# EAGLE design mainboard 1.1 (EAGLE 5.10)
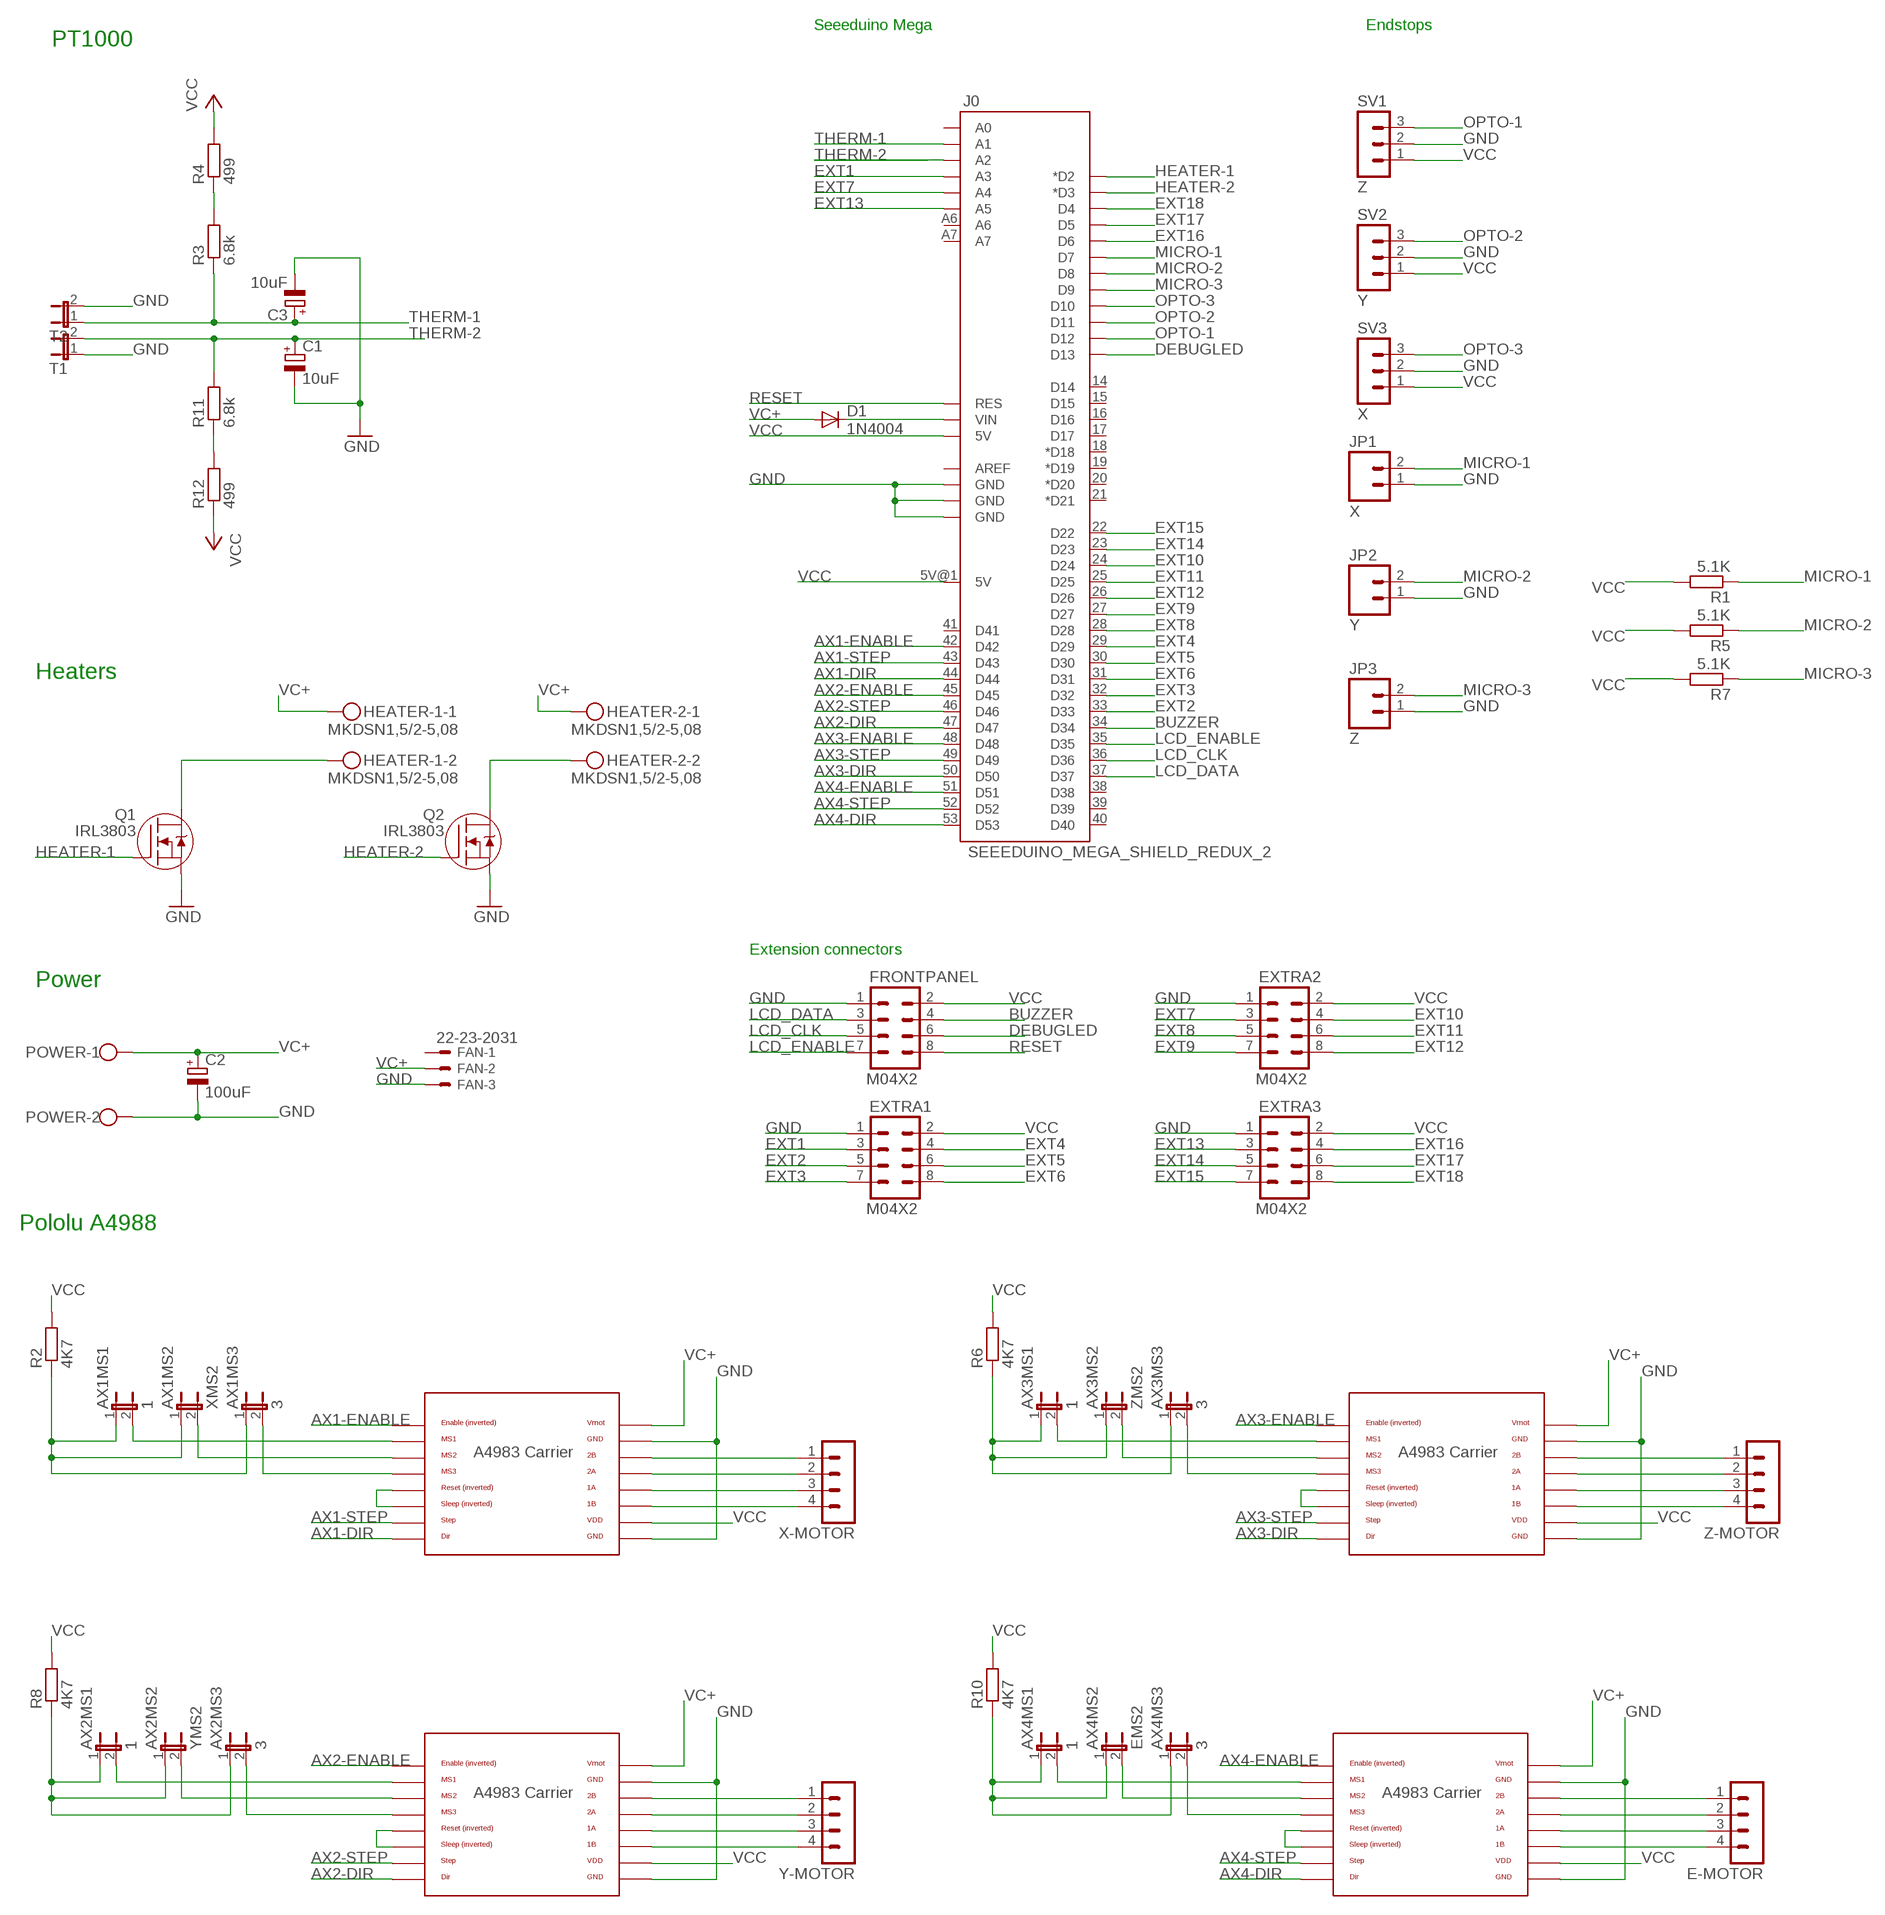
[diagram p0: schematic, sheet 1]

## Parts
AX1MS1  1  JUMPER-2PTH  [1X02]
AX1MS2  XMS2  JUMPER-2PTH  [1X02]
AX1MS3  3  JUMPER-2PTH  [1X02]
AX2MS1  1  JUMPER-2PTH  [1X02]
AX2MS2  YMS2  JUMPER-2PTH  [1X02]
AX2MS3  3  JUMPER-2PTH  [1X02]
AX3MS1  1  JUMPER-2PTH  [1X02]
AX3MS2  ZMS2  JUMPER-2PTH  [1X02]
AX3MS3  3  JUMPER-2PTH  [1X02]
AX4MS1  1  JUMPER-2PTH  [1X02]
AX4MS2  EMS2  JUMPER-2PTH  [1X02]
AX4MS3  3  JUMPER-2PTH  [1X02]
C1  10uF  CPOL-EUE2.5-6  [E2,5-6]
C2  100uF  CPOL-EUE2.5-6  [E2,5-6]
C3  10uF  CPOL-EUE2.5-6  [E2,5-6]
D1  1N4004  [DO41-10]
E-AXIS  POLOLU_A4983CARRIER  [A4983CARRIER]
E-MOTOR  MA04-1  [MA04-1]
EXTRA1  M04X2  [2X4]
EXTRA2  M04X2  [2X4]
EXTRA3  M04X2  [2X4]
FAN  22-23-2031  [22-23-2031]
FRONTPANEL  M04X2  [2X4]
HEATER-1  MKDSN1,5/2-5,08  [MKDSN1,5/2-5,08]
HEATER-2  MKDSN1,5/2-5,08  [MKDSN1,5/2-5,08]
J0  SEEEDUINO_MEGA_SHIELD_REDUX_2  [SEEEDUINO_MEGA_SHIELD_REDUX_2]
JP1  X  M02PTH  [1X02]
JP2  Y  M02PTH  [1X02]
JP3  Z  M02PTH  [1X02]
POWER  W237-102  [W237-102]
Q1  IRL3803  [TO220AB]
Q2  IRL3803  [TO220AB]
R1  5.1K  R-EU_0204/7  [0204/7]
R2  4K7  R-EU_0204/7  [0204/7]
R3  6.8k  R-EU_0204/7  [0204/7]
R4  499  R-EU_0204/7  [0204/7]
R5  5.1K  R-EU_0204/7  [0204/7]
R6  4K7  R-EU_0204/7  [0204/7]
R7  5.1K  R-EU_0204/7  [0204/7]
R8  4K7  R-EU_0204/7  [0204/7]
R10  4K7  R-EU_0204/7  [0204/7]
R11  6.8k  R-EU_0204/7  [0204/7]
R12  499  R-EU_0204/7  [0204/7]
SV1  Z  MA03-1  [MA03-1]
SV2  Y  MA03-1  [MA03-1]
SV3  X  MA03-1  [MA03-1]
T1  JUMPER-2-OLDPTH  [1X02]
T2  JUMPER-2-OLDPTH  [1X02]
X-AXIS  POLOLU_A4983CARRIER  [A4983CARRIER]
X-MOTOR  MA04-1  [MA04-1]
Y-AXIS  POLOLU_A4983CARRIER  [A4983CARRIER]
Y-MOTOR  MA04-1  [MA04-1]
Z-AXIS  POLOLU_A4983CARRIER  [A4983CARRIER]
Z-MOTOR  MA04-1  [MA04-1]

## Nets
AX1-DIR: J0.44(D44) X-AXIS.DIR
AX1-ENABLE: J0.42(D42) X-AXIS.EN
AX1-STEP: J0.43(D43) X-AXIS.STEP
AX2-DIR: J0.47(D47) Y-AXIS.DIR
AX2-ENABLE: J0.45(D45) Y-AXIS.EN
AX2-STEP: J0.46(D46) Y-AXIS.STEP
AX3-DIR: J0.50(D50) Z-AXIS.DIR
AX3-ENABLE: J0.48(D48) Z-AXIS.EN
AX3-STEP: J0.49(D49) Z-AXIS.STEP
AX4-DIR: E-AXIS.DIR J0.53(D53)
AX4-ENABLE: E-AXIS.EN J0.51(D51)
AX4-STEP: E-AXIS.STEP J0.52(D52)
BUZZER: FRONTPANEL.4 J0.34(D34)
DEBUGLED: FRONTPANEL.6 J0.13(D13)
EXT1: EXTRA1.3 J0.A3
EXT2: EXTRA1.5 J0.33(D33)
EXT3: EXTRA1.7 J0.32(D32)
EXT4: EXTRA1.4 J0.29(D29)
EXT5: EXTRA1.6 J0.30(D30)
EXT6: EXTRA1.8 J0.31(D31)
EXT7: EXTRA2.3 J0.A4
EXT8: EXTRA2.5 J0.28(D28)
EXT9: EXTRA2.7 J0.27(D27)
EXT10: EXTRA2.4 J0.24(D24)
EXT11: EXTRA2.6 J0.25(D25)
EXT12: EXTRA2.8 J0.26(D26)
EXT13: EXTRA3.3 J0.A5
EXT14: EXTRA3.5 J0.23(D23)
EXT15: EXTRA3.7 J0.22(D22)
EXT16: EXTRA3.4 J0.6(D6)
EXT17: EXTRA3.6 J0.5(D5)
EXT18: EXTRA3.8 J0.4(D4)
GND [GND]: C1.- C2.- C3.- E-AXIS.GND E-AXIS.GND@0(GND) EXTRA1.1 EXTRA2.1 EXTRA3.1 FAN.3 FRONTPANEL.1 J0.GND@0(GND) J0.GND@1(GND) J0.GND@2(GND) JP1.1 JP2.1 JP3.1 POWER.2 Q1.S Q2.S SV1.2 SV2.2 SV3.2 T1.1 T2.2 X-AXIS.GND X-AXIS.GND@0(GND) Y-AXIS.GND Y-AXIS.GND@0(GND) Z-AXIS.GND Z-AXIS.GND@0(GND)
HEATER-1: J0.2(*D2) Q1.G
HEATER-2: J0.3(*D3) Q2.G
LCD_CLK: FRONTPANEL.5 J0.36(D36)
LCD_DATA: FRONTPANEL.3 J0.37(D37)
LCD_ENABLE: FRONTPANEL.7 J0.35(D35)
MICRO-1: J0.7(D7) JP1.2 R1.1
MICRO-2: J0.8(D8) JP2.2 R5.1
MICRO-3: J0.9(D9) JP3.2 R7.1
N$1 [Heavy GND]: HEATER-2.2 Q2.D
N$2: AX1MS1.1 AX1MS2.1 AX1MS3.1 R2.1
N$3: X-AXIS.RST X-AXIS.SLP(SLEEP)
N$4: AX1MS3.2 X-AXIS.MS3
N$5: AX1MS2.2 X-AXIS.MS2
N$6: AX1MS1.2 X-AXIS.MS1
N$7 [Motor 12V]: X-AXIS.2B X-MOTOR.1
N$8 [Motor 12V]: X-AXIS.2A X-MOTOR.2
N$9 [Motor 12V]: X-AXIS.1A X-MOTOR.3
N$10 [Motor 12V]: X-AXIS.1B X-MOTOR.4
N$12: Z-AXIS.RST Z-AXIS.SLP(SLEEP)
N$13 [+12V]: D1.C J0.VIN
N$16: AX3MS3.2 Z-AXIS.MS3
N$17: AX3MS2.2 Z-AXIS.MS2
N$18: AX3MS1.2 Z-AXIS.MS1
N$19 [Motor 12V]: Z-AXIS.2B Z-MOTOR.1
N$20 [Motor 12V]: Z-AXIS.2A Z-MOTOR.2
N$21 [Motor 12V]: Z-AXIS.1A Z-MOTOR.3
N$22 [Motor 12V]: Z-AXIS.1B Z-MOTOR.4
N$23: AX2MS1.1 AX2MS2.1 AX2MS3.1 R8.1
N$24: Y-AXIS.RST Y-AXIS.SLP(SLEEP)
N$25: AX2MS3.2 Y-AXIS.MS3
N$26: AX2MS2.2 Y-AXIS.MS2
N$27: AX2MS1.2 Y-AXIS.MS1
N$28 [Motor 12V]: Y-AXIS.2B Y-MOTOR.1
N$29 [Motor 12V]: Y-AXIS.2A Y-MOTOR.2
N$30 [Motor 12V]: Y-AXIS.1A Y-MOTOR.3
N$31 [Motor 12V]: Y-AXIS.1B Y-MOTOR.4
N$32: AX4MS1.1 AX4MS2.1 AX4MS3.1 R10.1
N$33: E-AXIS.RST E-AXIS.SLP(SLEEP)
N$34: AX4MS3.2 E-AXIS.MS3
N$35: AX4MS2.2 E-AXIS.MS2
N$36: AX4MS1.2 E-AXIS.MS1
N$37 [Motor 12V]: E-AXIS.2B E-MOTOR.1
N$38 [Motor 12V]: E-AXIS.2A E-MOTOR.2
N$39 [Motor 12V]: E-AXIS.1A E-MOTOR.3
N$40 [Motor 12V]: E-AXIS.1B E-MOTOR.4
N$41: R11.1 R12.2
N$42: R3.2 R4.1
N$52: AX3MS1.1 AX3MS2.1 AX3MS3.1 R6.1
N$65 [Heavy GND]: HEATER-1.2 Q1.D
OPTO-1: J0.12(D12) SV1.3
OPTO-2: J0.11(D11) SV2.3
OPTO-3: J0.10(D10) SV3.3
RESET: FRONTPANEL.8 J0.RST(RES)
THERM-1: C3.+ J0.A1 R3.1 T2.1
THERM-2: C1.+ J0.A2 R11.2 T1.2
VC+ [+12V]: C2.+ D1.A E-AXIS.VMOT FAN.2 HEATER-1.1 HEATER-2.1 POWER.1 X-AXIS.VMOT Y-AXIS.VMOT Z-AXIS.VMOT
VCC [+5V]: E-AXIS.VDD EXTRA1.2 EXTRA2.2 EXTRA3.2 FRONTPANEL.2 J0.5V@0(5V) J0.5V@1(5V) R1.2 R2.2 R4.2 R5.2 R6.2 R7.2 R8.2 R10.2 R12.1 SV1.1 SV2.1 SV3.1 X-AXIS.VDD Y-AXIS.VDD Z-AXIS.VDD
Unconnected: FAN.1 J0.14(D14) J0.15(D15) J0.16(D16) J0.17(D17) J0.18(*D18) J0.19(*D19) J0.20(*D20) J0.21(*D21) J0.38(D38) J0.39(D39) J0.40(D40) J0.41(D41) J0.A0 J0.A6 J0.A7 J0.AREF

## Notes on the sheet
- Seeeduino Mega | Endstops
- PT1000
- Heaters
- Extension connectors
- Power
- Pololu A4988

## Library data of the parts
AX1MS1-AX1MS3 AX2MS1-AX2MS3 AX3MS1-AX3MS3 AX4MS1-AX4MS3 = SparkFun:JUMPER-2: Jumper Basic 0.1" spaced jumper. Use with breakaway headers.
C1-C3 = rcl:CPOL-EU: POLARIZED CAPACITOR, European symbol
D1 = diode:1N4004: DIODE general purpose rectifier, 1 A
E-AXIS X-AXIS Y-AXIS Z-AXIS = RepRapjr:POLOLU_A4983CARRIER
E-MOTOR X-MOTOR Y-MOTOR Z-MOTOR = con-lstb:MA04-1: PIN HEADER
EXTRA1-EXTRA3 FRONTPANEL = SparkFun:M04X2
FAN = con-molex:22-23-2031: .100" (2.54mm) Center Header - 3 Pin
HEATER-1 HEATER-2 = con-phoenix-508:MKDSN1,5/2-5,08: MKDSN 1,5/ 2-5,08 Printklemme Nennstrom: 13,5 A Nennspannung: 250 V Rastermaß: 5,08 mm Polzahl: 2 Anschlussart: Schraubanschluss Montage: Löten Anschlussrichtung Leiter/Platine: 0 ° Artikelnummer: 1729128 Source: http://eshop.phoenixcontact.com .. 1729128.pdf
J0 = RepRapjr:SEEEDUINO_MEGA_SHIELD_REDUX_2
JP1-JP3 = SparkFun:M02: Header 2 Standard 2-pin 0.1" header. Use with straight break away headers (SKU : PRT-00116), right angle break away headers (PRT-00553), swiss pins (PRT-00743), machine pins (PRT-00117), and female headers (PRT-00115). Molex polarized connector foot print use with SKU : PRT-08233 with associated crimp pins and housings.
POWER = con-wago-500:W237-102: WAGO SCREW CLAMP
Q1 Q2 = local-lib:IRL3803
R1 R5 R7 = resistor:R-EU_: RESISTOR, European symbol
R2-R4 R6 R8 R10-R12 = rcl:R-EU_: RESISTOR, European symbol
SV1-SV3 = con-lstb:MA03-1: PIN HEADER
T1 T2 = SparkFun:JUMPER-2-OLD: Jumper Basic 0.1" spaced jumper. Use with breakaway headers.

## Net classes
0 default: width 0.24 mm
1 +5V: width 0.406 mm
2 +12V: width 0.813 mm
3 GND: width 0.406 mm
4 Motor 12V: width 0.813 mm
5 Heavy GND: width 2.54 mm

## Board
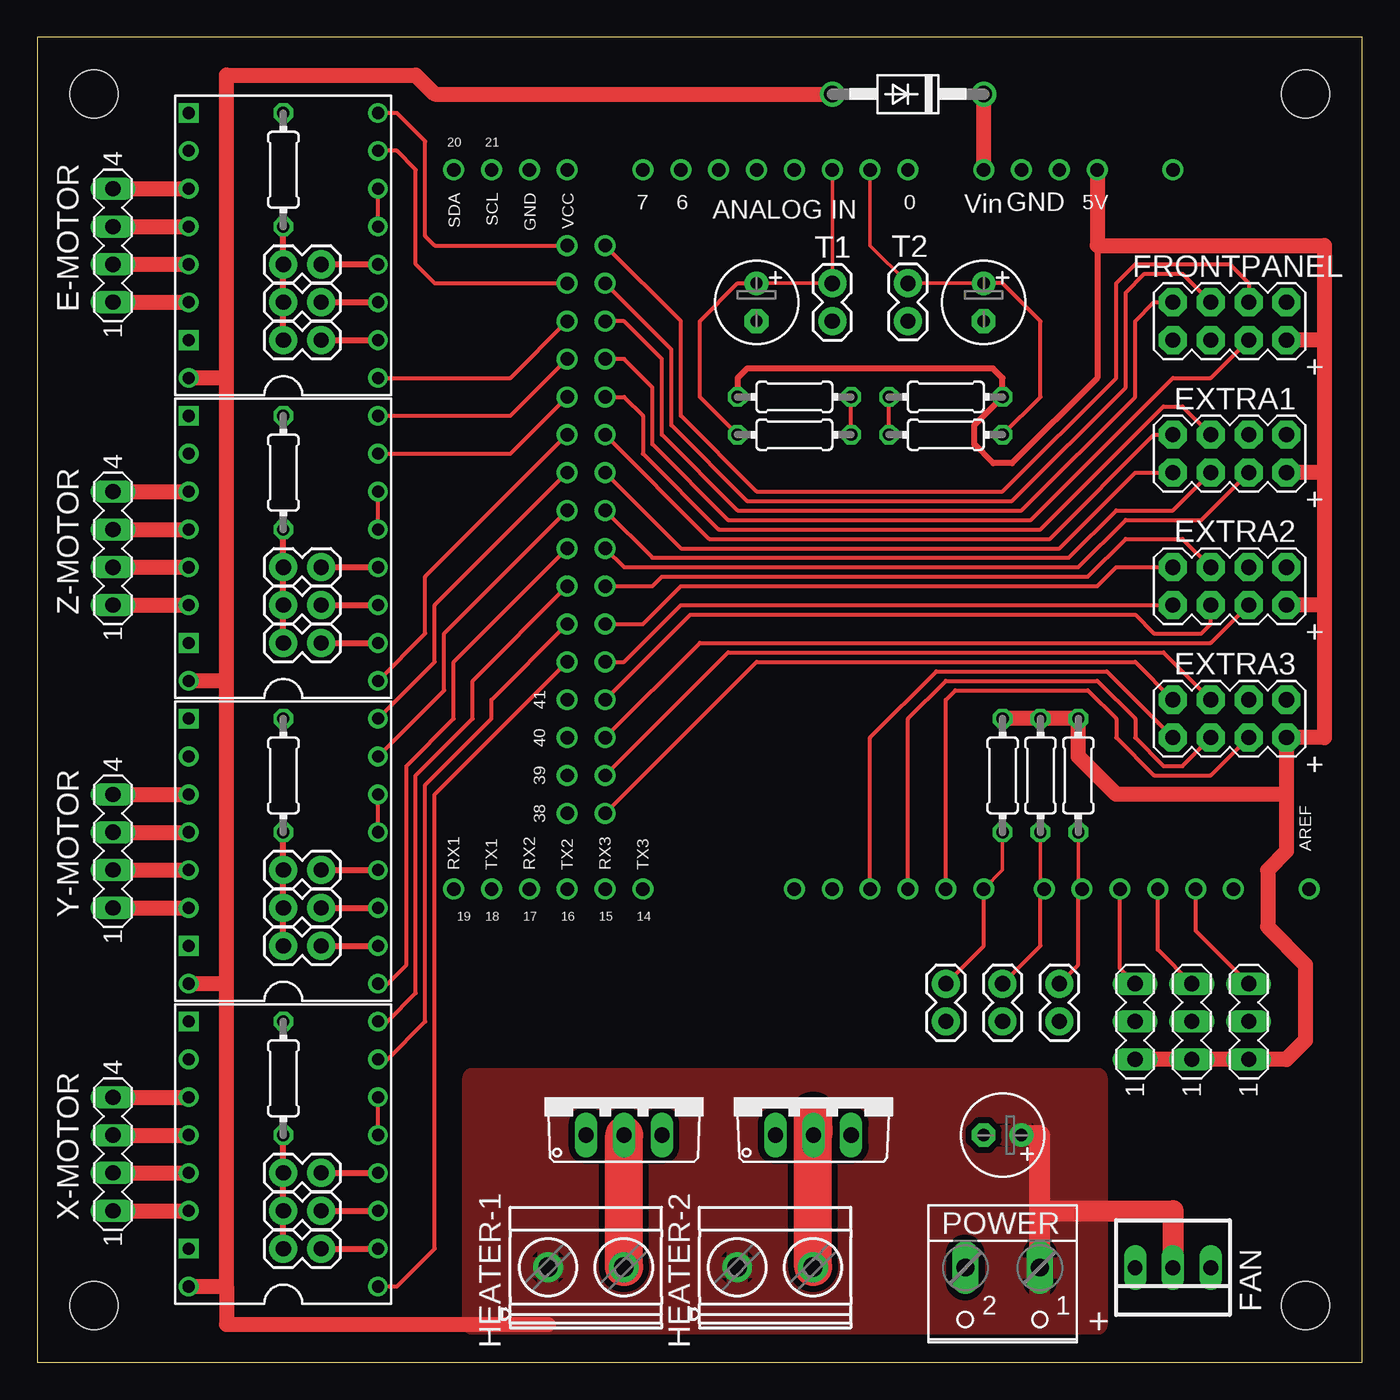
[diagram p1: board, top side]
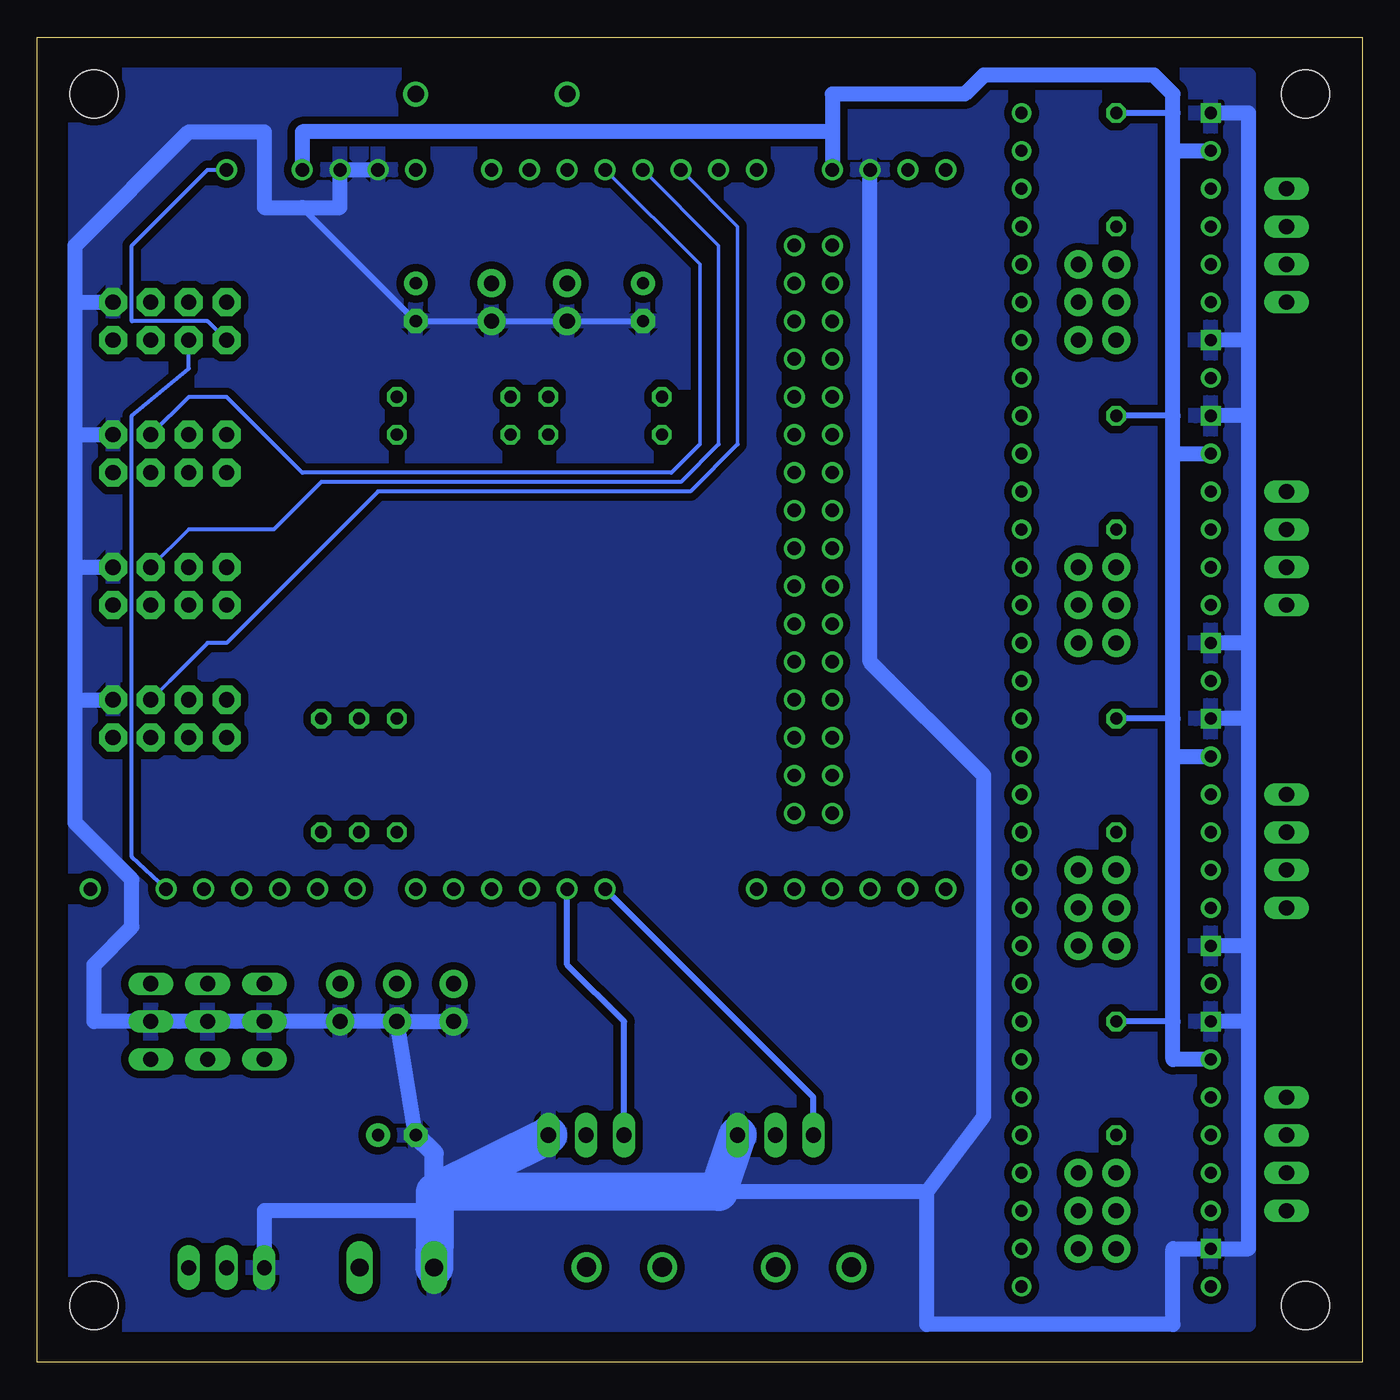
[diagram p2: board, bottom side, seen from below]

Size 88.9 x 88.9 mm. Coordinates in mm from the lower left corner, seen from the top.
Outline: 88.9,0 88.9,88.9 0,88.9 0,0 88.9,0
Copper layers (1*16): Top 0.018mm / dielectric 1.5mm / Bottom 0.018mm
Design rules "resonit_u18": minimum track width 0.15mm, minimum drill 0.6mm, track to track 0.15mm, track to pad 0.15mm, pad to pad 0.15mm, via to via 0.15mm, smd to smd 0.15mm, copper to edge 0.3mm, drill to drill 8mil, minimum pad ring 10mil, minimum via ring 8mil, stop-mask expansion 0.1mm, vias tented up to drill 0mil, thermal gap 10mil
Holes 3.2 mm at 85.09,3.81 85.09,85.09 3.81,3.81 3.81,85.09

### Footprints (pad centres in the part's own frame; a part is rotated, then mirrored left to right if it is on the bottom)
1X02 = drill 1.016 pad 1.88 round: 1 0,0; 2 2.54,0
E2,5-6 = drill 0.813 pad 1.6 round: + -1.27,0 | drill 0.813 pad 1.6 octagon: - 1.27,0
DO41-10 = drill 1.118 round: A 5.08,0; C -5.08,0
A4983CARRIER = drill 0.813 round: 1A 8.89,1.27; 1B 11.43,1.27; 2A 6.35,1.27; 2B 3.81,1.27; DIR 16.51,-11.43; EN -1.27,-11.43; MS1 1.27,-11.43; MS2 3.81,-11.43; MS3 6.35,-11.43; RST 8.89,-11.43; SLP 11.43,-11.43; STEP 13.97,-11.43; VDD 13.97,1.27; VMOT -1.27,1.27 | drill 0.813 square: GND 16.51,1.27; GND@0 1.27,1.27
MA04-1 = drill 1.016 long: 1 -3.81,0; 2 -1.27,0; 3 1.27,0; 4 3.81,0
2X4 = drill 1.016 pad 1.88 octagon: 1 -3.81,-1.27; 2 -3.81,1.27; 3 -1.27,-1.27; 4 -1.27,1.27; 5 1.27,-1.27; 6 1.27,1.27; 7 3.81,-1.27; 8 3.81,1.27
22-23-2031 = drill 1 long: 1 -2.54,0; 2 0,0; 3 2.54,0
MKDSN1,5/2-5,08 = drill 1.3 pad 2 round: 1 -2.561,0.025; 2 2.519,0.025
SEEEDUINO_MEGA_SHIELD_REDUX_2 = drill 0.9 round: 2 41.91,48.26; 3 39.37,48.26; 4 36.83,48.26; 5 34.29,48.26; 5V@0 21.59,0; 5V@1 57.15,0; 6 31.75,48.26; 7 29.21,48.26; 8 25.146,48.26; 9 22.606,48.26; 10 20.066,48.26; 11 17.526,48.26; 12 14.986,48.26; 13 12.446,48.26; 14 52.07,48.26; 15 54.61,48.26; 16 57.15,48.26; 17 59.69,48.26; 18 62.23,48.26; 19 64.77,48.26; 20 64.77,0; 21 62.23,0; 22 54.61,43.18; 23 54.61,40.64; 24 54.61,38.1; 25 54.61,35.56; 26 54.61,33.02; 27 54.61,30.48; 28 54.61,27.94; 29 54.61,25.4; 30 54.61,22.86; 31 54.61,20.32; 32 54.61,17.78; 33 54.61,15.24; 34 54.61,12.7; 35 54.61,10.16; 36 54.61,7.62; 37 54.61,5.08; 38 57.15,43.18; 39 57.15,40.64; 40 57.15,38.1; 41 57.15,35.56; 42 57.15,33.02; 43 57.15,30.48; 44 57.15,27.94; 45 57.15,25.4; 46 57.15,22.86; 47 57.15,20.32; 48 57.15,17.78; 49 57.15,15.24; 50 57.15,12.7; 51 57.15,10.16; 52 57.15,7.62; 53 57.15,5.08; A0 34.29,0; A1 36.83,0; A2 39.37,0; A3 41.91,0; A4 44.45,0; A5 46.99,0; A6 49.53,0; A7 52.07,0; AREF 7.366,48.26; GND@0 24.13,0; GND@1 26.67,0; GND@2 59.69,0; RST 16.51,0; VIN 29.21,0
W237-102 = drill 1.194 long: 1 -2.5,-1.27; 2 2.5,-1.27
TO220AB = drill 1.016 long: D 0,0; G -2.54,0; S 2.54,0
0204/7 = drill 0.813 octagon: 1 -3.81,0; 2 3.81,0
MA03-1 = drill 1.016 long: 1 -2.54,0; 2 0,0; 3 2.54,0

### Placement (x,y rotation side)
AX1MS1  16.51,7.62 0 top
AX1MS2  16.51,10.16 0 top
AX1MS3  16.51,12.7 0 top
AX2MS1  16.51,27.94 0 top
AX2MS2  16.51,30.48 0 top
AX2MS3  16.51,33.02 0 top
AX3MS1  16.51,48.26 0 top
AX3MS2  16.51,50.8 0 top
AX3MS3  16.51,53.34 0 top
AX4MS1  16.51,68.58 0 top
AX4MS2  16.51,71.12 0 top
AX4MS3  16.51,73.66 0 top
C1  48.26,71.12 270 top
C2  64.77,15.24 180 top
C3  63.5,71.12 270 top
D1  58.42,85.09 180 top
E-AXIS  11.43,67.31 90 top
E-MOTOR  5.08,74.93 90 top
EXTRA1  80.01,60.96 180 top
EXTRA2  80.01,52.07 180 top
EXTRA3  80.01,43.18 180 top
FAN  76.2,6.35 180 top
FRONTPANEL  80.01,69.85 180 top
HEATER-1  36.83,6.35 0 top
HEATER-2  49.53,6.35 0 top
J0  92.71,80.01 180 top
JP1  60.96,22.86 90 top
JP2  64.77,22.86 90 top
JP3  68.58,22.86 90 top
POWER  64.77,5.08 180 top
Q1  39.37,15.24 0 top
Q2  52.07,15.24 0 top
R1  64.77,39.37 90 top
R2  16.51,19.05 90 top
R3  60.96,62.23 180 top
R4  60.96,64.77 0 top
R5  67.31,39.37 90 top
R6  16.51,59.69 90 top
R7  69.85,39.37 90 top
R8  16.51,39.37 90 top
R10  16.51,80.01 90 top
R11  50.8,62.23 180 top
R12  50.8,64.77 0 top
SV1  81.28,22.86 90 top
SV2  77.47,22.86 90 top
SV3  73.66,22.86 90 top
T1  53.34,69.85 90 top
T2  58.42,72.39 270 top
X-AXIS  11.43,6.35 90 top
X-MOTOR  5.08,13.97 90 top
Y-AXIS  11.43,26.67 90 top
Y-MOTOR  5.08,34.29 90 top
Z-AXIS  11.43,46.99 90 top
Z-MOTOR  5.08,54.61 90 top

### Tracks (layer width: path | path; a pad name or v marks a point on that pad's centre or on a via)
AX1-DIR
  Top 0.254: X-AXIS.DIR 23.5,22.86 25.4,24.77 25.4,39.37 29.21,43.18 29.21,45.72 J0.44
AX1-ENABLE
  Top 0.254: J0.42 26.67,38.1 26.67,7.62 24.13,5.08 X-AXIS.EN
AX1-STEP
  Top 0.254: X-AXIS.STEP 23.5,20.32 26.04,22.86 26.04,38.73 30.48,43.18 30.48,44.45 J0.43
AX2-DIR
  Top 0.254: J0.47 26.67,50.8 26.67,46.99 Y-AXIS.DIR
AX2-ENABLE
  Top 0.254: Y-AXIS.EN 23.5,25.4 24.77,26.67 24.77,40.01 27.94,43.18 27.94,46.99 J0.45
AX2-STEP
  Top 0.254: Y-AXIS.STEP 27.3,45.09 27.3,48.9 J0.46
AX3-DIR
  Top 0.254: Z-AXIS.DIR 31.75,63.5 J0.50
AX3-ENABLE
  Top 0.254: Z-AXIS.EN 26.04,48.9 26.04,52.7 J0.48
AX3-STEP
  Top 0.254: Z-AXIS.STEP 31.75,60.96 J0.49
AX4-DIR
  Top 0.254: J0.53 26.67,74.93 26.04,75.56 26.04,81.92 24.13,83.82 E-AXIS.DIR
AX4-ENABLE
  Top 0.254: E-AXIS.EN 31.75,66.04 J0.51
AX4-STEP
  Top 0.254: E-AXIS.STEP 24.13,81.28 25.4,80.01 25.4,73.66 26.67,72.39 J0.52
BUZZER
  Top 0.254: FRONTPANEL.4 78.74,66.04 76.2,66.04 66.67,56.52 46.35,56.52 41.27,61.59 41.27,65.41 39.37,67.31 J0.34
DEBUGLED
  Bottom 0.254: FRONTPANEL.6 78.74,66.67 82.55,63.5 82.55,33.91 J0.13
EXT1
  Bottom 0.24: J0.A3 44.45,73.66 44.45,61.59
  Bottom 0.254: EXTRA1.3 78.74,64.77 76.2,64.77 71.12,59.69 46.35,59.69 44.45,61.59
EXT2
  Top 0.254: J0.33 39.37,64.77 40.64,63.5 40.64,60.96 45.72,55.88 67.31,55.88 75.56,64.14 76.83,64.14 EXTRA1.5
EXT3
  Top 0.254: EXTRA1.7 74.93,62.23 67.94,55.24 45.09,55.24 J0.32
EXT4
  Top 0.254: J0.29 39.37,53.34 69.85,53.34 73.03,56.52 78.11,56.52 EXTRA1.4
EXT5
  Top 0.254: J0.30 41.27,53.98 69.22,53.98 72.39,57.15 76.2,57.15 EXTRA1.6
EXT6
  Top 0.254: EXTRA1.8 73.66,59.69 68.58,54.61 43.18,54.61 J0.31
EXT7
  Bottom 0.24: J0.A4 43.18,74.93 43.18,61.59 | 78.74,55.88 EXTRA2.3
  Bottom 0.254: 78.74,55.88 73.03,55.88 69.85,59.05 45.72,59.05 43.18,61.59
EXT8
  Top 0.254: J0.28 41.27,52.07 41.91,52.7 70.48,52.7 73.03,55.24 76.83,55.24 EXTRA2.5
EXT9
  Top 0.254: EXTRA2.7 72.39,53.34 71.12,52.07 43.18,52.07 40.64,49.53 J0.27
EXT10
  Top 0.254: EXTRA2.4 78.74,48.26 44.45,48.26 J0.24
EXT11
  Top 0.254: J0.25 43.81,50.16 73.66,50.16 74.93,48.9 78.11,48.9 78.74,49.53 EXTRA2.6
EXT12
  Top 0.254: EXTRA2.8 43.18,50.8 39.37,46.99 J0.26
EXT13
  Bottom 0.24: J0.A5 41.91,76.2 41.91,61.59 | 80.01,45.72 EXTRA3.3
  Bottom 0.254: 80.01,45.72 77.47,48.26 76.2,48.26 66.04,58.42 45.09,58.42 41.91,61.59
EXT14
  Top 0.254: J0.23 46.35,47.62 75.56,47.62 EXTRA3.5
EXT15
  Top 0.254: EXTRA3.7 73.66,46.99 48.26,46.99 J0.22
EXT16
  Top 0.254: EXTRA3.4 78.74,39.37 74.93,39.37 72.39,41.91 72.39,43.18 70.48,45.09 61.59,45.09 60.96,44.45 J0.6
EXT17
  Top 0.254: J0.5 58.42,43.18 60.96,45.72 71.12,45.72 73.66,43.18 73.66,41.91 75.56,40.01 76.83,40.01 EXTRA3.6
EXT18
  Top 0.254: EXTRA3.8 71.75,46.35 60.33,46.35 55.88,41.91 J0.4
GND
  Bottom 0.406: C1.- T1.1 T2.2 C3.- 71.12,77.47
  Bottom 1.016: FAN.3 73.66,10.16 62.27,10.16 | JP2.1 JP3.1 SV3.2 SV2.2 SV1.2 85.09,22.86 85.09,26.67 82.55,29.21 82.55,32.38 86.36,36.2 86.36,44.45 | JP2.1 JP1.1 | C2.- JP2.1 | J0.GND@1 J0.GND@0 68.58,77.47 71.12,77.47 73.66,77.47 73.66,82.55 78.74,82.55 86.36,74.93 86.36,71.12 | 86.36,71.12 FRONTPANEL.1 | 86.36,62.23 EXTRA1.1 | 86.36,62.23 86.36,71.12 | 86.36,53.34 EXTRA2.1 | 86.36,53.34 86.36,62.23 | 86.36,44.45 EXTRA3.1 | 86.36,44.45 86.36,53.34 | 7.62,68.58 E-AXIS.GND@0 | 7.62,63.5 7.62,68.58 | 7.62,63.5 Z-AXIS.GND | 7.62,48.26 7.62,63.5 | 7.62,48.26 Z-AXIS.GND@0 | 7.62,43.18 7.62,48.26 | 7.62,43.18 Y-AXIS.GND | 7.62,27.94 7.62,43.18 | 7.62,27.94 Y-AXIS.GND@0 | 7.62,22.86 7.62,27.94 | 7.62,22.86 X-AXIS.GND | 7.62,22.86 7.62,7.62 X-AXIS.GND@0 12.7,7.62 12.7,2.54 29.21,2.54 29.21,11.43 | 29.21,11.43 43.18,11.43 | E-AXIS.GND 7.62,83.82 7.62,68.58 | J0.GND@2 33.02,46.99 25.4,39.37 25.4,16.51 29.21,11.43
  Bottom 1.27: C2.- 62.27,14.01 62.27,10.16 POWER.2
  Bottom 2.54: 62.23,11.43 Q2.S | 62.23,11.43 62.23,8.93 POWER.2 | Q1.S 43.18,11.43 62.23,11.43
  pour Bottom (isolate 0.5): 7.62,86.36 86.36,86.36 86.36,2.54 7.62,2.54
HEATER-1
  Bottom 0.406: Q1.G 36.83,17.78 J0.2
HEATER-2
  Bottom 0.406: Q2.G 49.53,22.86 53.34,26.67 J0.3
LCD_CLK
  Top 0.254: J0.36 42.55,67.94 42.55,62.87 47.62,57.78 65.41,57.78 73.03,65.41 73.03,71.75 74.3,73.03 76.83,73.03 FRONTPANEL.5
LCD_DATA
  Top 0.254: FRONTPANEL.3 81.28,72.39 80.01,73.66 73.66,73.66 72.39,72.39 72.39,66.04 64.77,58.42 48.26,58.42 43.18,63.5 43.18,69.85 J0.37
LCD_ENABLE
  Top 0.254: J0.35 39.37,69.85 41.91,67.31 41.91,62.23 46.99,57.15 66.04,57.15 73.66,64.77 73.66,69.85 74.93,71.12 FRONTPANEL.7
MICRO-1
  Top 0.24: J0.7 64.77,33.02 R1.1
  Top 0.254: J0.7 63.5,27.94 JP1.2
MICRO-2
  Top 0.24: R5.1 67.31,31.75 J0.8
  Top 0.254: 67.31,31.75 67.31,27.94 JP2.2
MICRO-3
  Top 0.24: R7.1 69.85,31.75 J0.9
  Top 0.254: 69.85,31.75 69.85,26.67 JP3.2
N$1
  Top 2.54: HEATER-2.2 52.05,16.49 Q2.D
N$2
  Top 0.406: AX1MS1.1 AX1MS2.1 AX1MS3.1 R2.1
N$3
  Top 0.254: X-AXIS.RST X-AXIS.SLP
N$4
  Top 0.406: AX1MS3.2 X-AXIS.MS3
N$5
  Top 0.406: AX1MS2.2 X-AXIS.MS2
N$6
  Top 0.406: AX1MS1.2 X-AXIS.MS1
N$7
  Top 1.016: X-MOTOR.1 X-AXIS.2B
N$8
  Top 1.016: X-MOTOR.2 X-AXIS.2A
N$9
  Top 1.016: X-MOTOR.3 X-AXIS.1A
N$10
  Top 1.016: X-MOTOR.4 X-AXIS.1B
N$12
  Top 0.254: Z-AXIS.RST Z-AXIS.SLP
N$13
  Top 1.016: J0.VIN D1.C
N$16
  Top 0.406: AX3MS3.2 Z-AXIS.MS3
N$17
  Top 0.406: AX3MS2.2 Z-AXIS.MS2
N$18
  Top 0.406: AX3MS1.2 Z-AXIS.MS1
N$19
  Top 1.016: Z-MOTOR.1 Z-AXIS.2B
N$20
  Top 1.016: Z-MOTOR.2 Z-AXIS.2A
N$21
  Top 1.016: Z-MOTOR.3 Z-AXIS.1A
N$22
  Top 1.016: Z-MOTOR.4 Z-AXIS.1B
N$23
  Top 0.406: AX2MS1.1 AX2MS2.1 AX2MS3.1 R8.1
N$24
  Top 0.254: Y-AXIS.RST Y-AXIS.SLP
N$25
  Top 0.406: AX2MS3.2 Y-AXIS.MS3
N$26
  Top 0.406: AX2MS2.2 Y-AXIS.MS2
N$27
  Top 0.406: AX2MS1.2 Y-AXIS.MS1
N$28
  Top 1.016: Y-MOTOR.1 Y-AXIS.2B
N$29
  Top 1.016: Y-MOTOR.2 Y-AXIS.2A
N$30
  Top 1.016: Y-MOTOR.3 Y-AXIS.1A
N$31
  Top 1.016: Y-MOTOR.4 Y-AXIS.1B
N$32
  Top 0.406: AX4MS1.1 AX4MS2.1 AX4MS3.1 R10.1
N$33
  Top 0.254: E-AXIS.RST E-AXIS.SLP
N$34
  Top 0.406: AX4MS3.2 E-AXIS.MS3
N$35
  Top 0.406: AX4MS2.2 E-AXIS.MS2
N$36
  Top 0.406: AX4MS1.2 E-AXIS.MS1
N$37
  Top 1.016: E-MOTOR.1 E-AXIS.2B
N$38
  Top 1.016: E-MOTOR.2 E-AXIS.2A
N$39
  Top 1.016: E-MOTOR.3 E-AXIS.1A
N$40
  Top 1.016: E-MOTOR.4 E-AXIS.1B
N$41
  Top 0.254: R11.1 R12.2
N$42
  Top 0.254: R3.2 R4.1
N$52
  Top 0.406: AX3MS1.1 AX3MS2.1 AX3MS3.1 R6.1
N$65
  Top 2.54: Q1.D 39.37,6.4 HEATER-1.2
OPTO-1
  Top 0.254: J0.12 77.72,28.96 SV1.3
OPTO-2
  Top 0.254: J0.11 75.18,27.69 SV2.3
OPTO-3
  Top 0.254: J0.10 72.64,26.42 SV3.3
RESET
  Bottom 0.254: J0.RST 77.47,80.01 82.55,74.93 82.55,69.85 77.47,69.85 FRONTPANEL.8
THERM-1
  Top 0.24: J0.A1 55.88,74.93 T2.1 C3.+
  Top 0.254: C3.+ 64.77,72.39 67.31,69.85 67.31,64.77 R3.1
THERM-2
  Top 0.24: J0.A2 T1.2 C1.+
  Top 0.254: C1.+ 46.99,72.39 44.45,69.85 44.45,64.77 R11.2
VC+
  Top 1.016: 34.29,2.54 12.7,2.54 12.7,5.08 | X-AXIS.VMOT 12.7,5.08 | 12.7,5.08 12.7,25.4 | 12.7,25.4 Y-AXIS.VMOT | 12.7,45.72 Z-AXIS.VMOT | 12.7,25.4 12.7,45.72 | 12.7,66.04 E-AXIS.VMOT | 12.7,45.72 12.7,66.04 | D1.A 26.67,85.09 25.4,86.36 12.7,86.36 12.7,66.04
  Top 1.422: POWER.1 67.27,10.16 | 67.27,10.16 67.27,15.2 C2.+ | FAN.2 76.2,10.16 67.27,10.16
  pour Top (isolate 0.406): 29.21,2.54 29.21,19.05 71.12,19.05 71.12,2.54
VCC
  Top 0.406: R12.1 46.99,66.04 47.62,66.67 64.14,66.67 64.77,66.04 R4.2 62.87,62.87 62.87,61.59 64.14,60.33 65.41,60.33 71.12,66.04 71.12,74.93
  Top 1.016: J0.5V@0 71.12,74.93 86.36,74.93 86.36,68.58 | 86.36,68.58 FRONTPANEL.2 | 86.36,68.58 86.36,59.69 | 86.36,59.69 EXTRA1.2 | 86.36,59.69 86.36,50.8 | 86.36,50.8 EXTRA2.2 | 86.36,50.8 86.36,41.91 EXTRA3.2 83.82,38.1 | 83.82,38.1 83.82,34.29 82.55,33.02 82.55,29.21 85.09,26.67 85.09,21.59 83.82,20.32 SV1.1 SV2.1 SV3.1 | R1.2 R5.2 R7.2 69.85,40.64 72.39,38.1 83.82,38.1
  Bottom 0.406: 12.7,83.82 R10.2 | 12.7,63.5 R6.2 | 12.7,43.18 R8.2 | 12.7,22.86 R2.2
  Bottom 1.016: 12.7,81.28 12.7,83.82 12.7,85.09 13.97,86.36 25.4,86.36 26.67,85.09 35.56,85.09 35.56,82.55 | 35.56,82.55 71.12,82.55 J0.5V@0 | 12.7,81.28 E-AXIS.VDD | 12.7,60.96 12.7,63.5 12.7,81.28 | 12.7,60.96 Z-AXIS.VDD | 12.7,40.64 12.7,43.18 12.7,60.96 | 12.7,40.64 Y-AXIS.VDD | 12.7,40.64 12.7,22.86 12.7,20.32 X-AXIS.VDD | 35.56,82.55 J0.5V@1

### Text on the board
tPlace: + | + | + | + | +